# EAGLE board LCMeter (EAGLE 6.1)
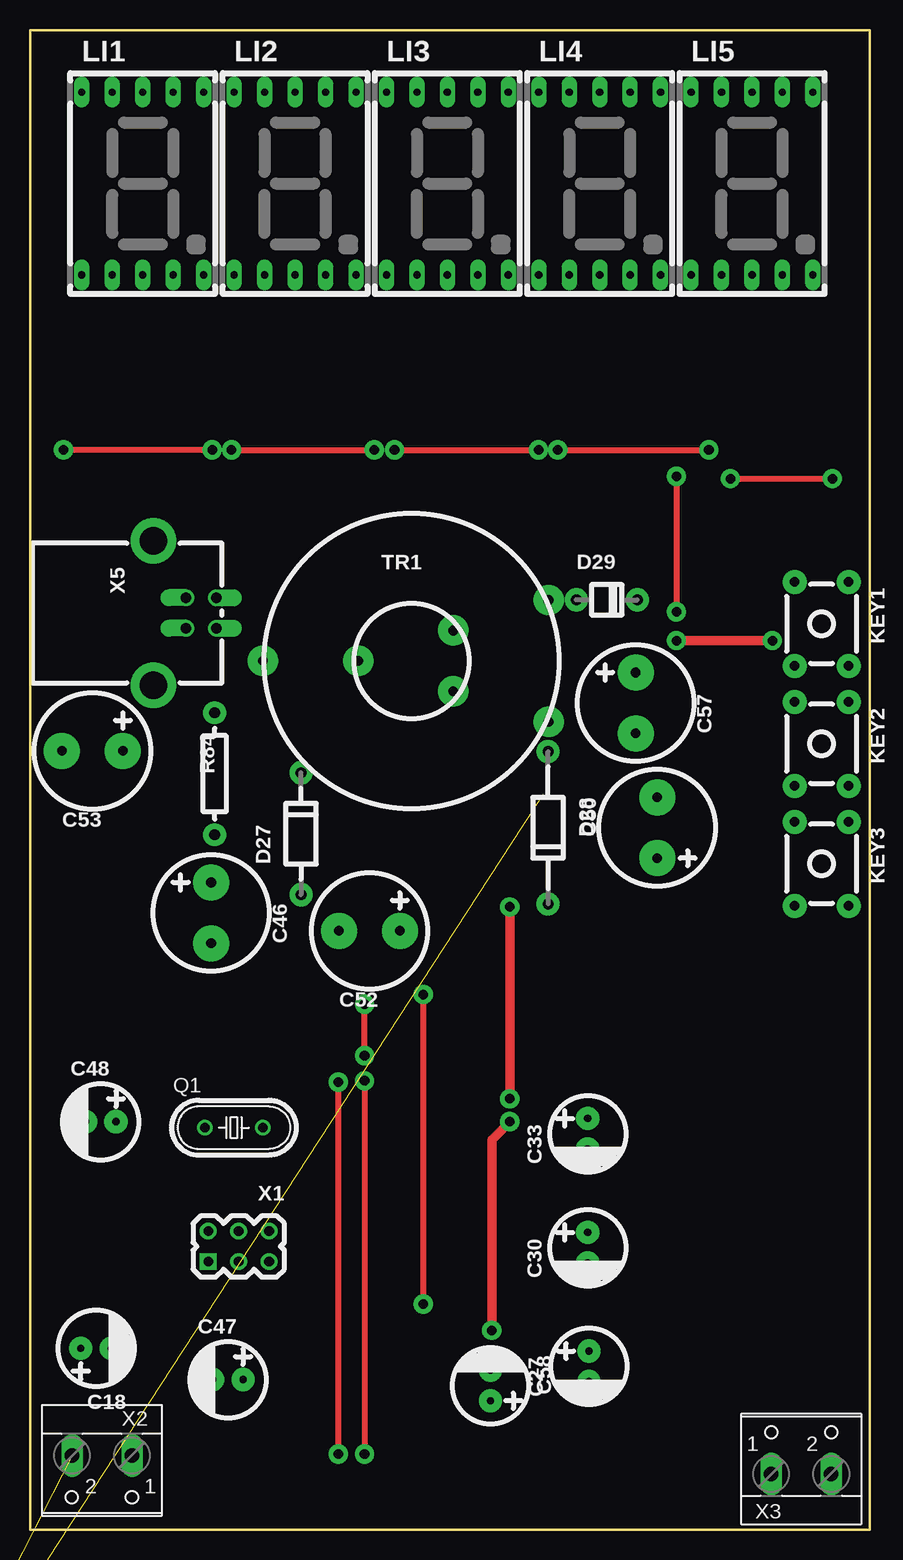
[diagram p4: board, top side]
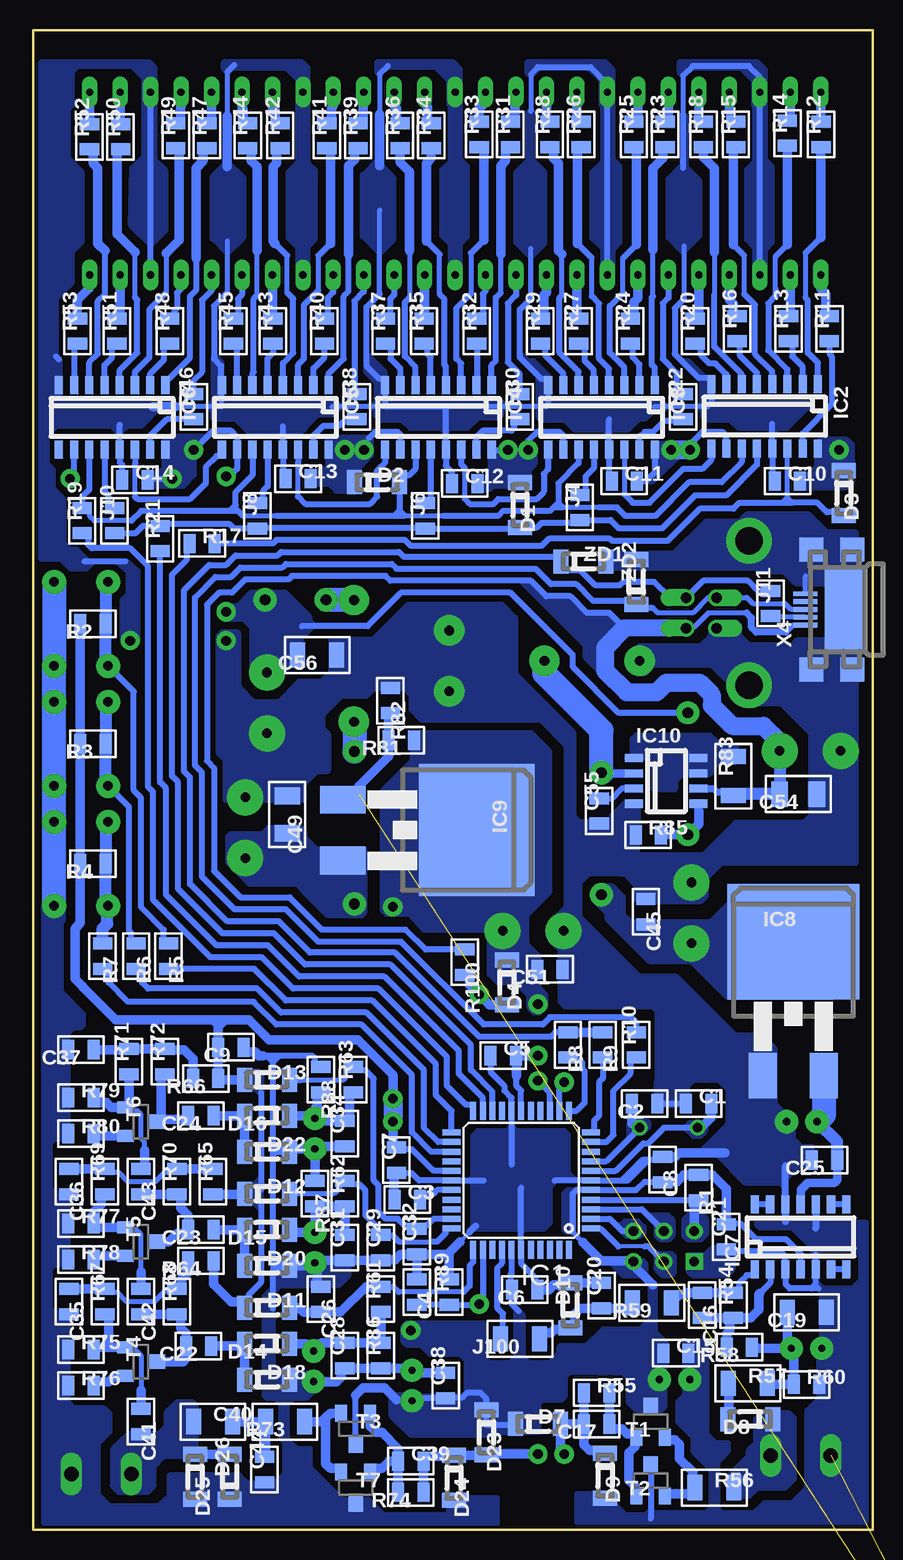
[diagram p5: board, bottom side, seen from below]

Size 70 x 125 mm. Coordinates in mm from the lower left corner, seen from the top.
Outline: 0,0 0,125 70,125 70,0 0,0
Copper layers (1*16): Top 0.035mm / dielectric 1.5mm / Bottom 0.035mm
Design rules: minimum track width 0.35mm, minimum drill 0.6mm, track to track 0.25mm, track to pad 0.25mm, pad to pad 0.25mm, via to via 0.35mm, smd to smd 8mil, copper to edge 0.2mm, drill to drill 8mil, minimum pad ring 10mil, minimum via ring 8mil, stop-mask expansion 4mil, vias tented up to drill 0mil, thermal gap 10mil

## Footprints (pad centres in the part's own frame; a part is rotated, then mirrored left to right if it is on the bottom)
RSMD_0805 = smd 1 x 1.6: PAD_0 -1.05,0; PAD_1 1.05,0
CE_6.3MM = drill 0.6 pad 1.93: + 1.27,0; - -1.27,0
RSMD_1206_BIG_GAP = smd 1.25 x 2.1: PAD_0 -1.625,0; PAD_1 1.625,0
CE_10MM = drill 0.8 pad 3: + 2.54,0; - -2.54,0
RSMD_1206 = smd 1.4 x 2.1: PAD_0 -1.55,0; PAD_1 1.55,0
SOD-80 = smd 1.25 x 2: ANODE 1.875,0; CATHODE -1.875,0
DO-41_10MM = drill 0.9 pad 1.93: ANODE -5.08,0; CATHODE 5.08,0
DO-41_12.5MM = drill 0.9 pad 1.93: ANODE -6.35,0; CATHODE 6.35,0
DO-41_5MM = drill 0.9 pad 1.93: ANODE -2.54,0; CATHODE 2.54,0
TQFP44 = smd 1.5 x 0.5: 1 -5.8,4; 2 -5.8,3.2; 3 -5.8,2.4; 4 -5.8,1.6; 5 -5.8,0.8; 6 -5.8,0; 7 -5.8,-0.8; 8 -5.8,-1.6; 9 -5.8,-2.4; 10 -5.8,-3.2; 11 -5.8,-4; 23 5.8,-4; 24 5.8,-3.2; 25 5.8,-2.4; 26 5.8,-1.6; 27 5.8,-0.8; 28 5.8,0; 29 5.8,0.8; 30 5.8,1.6; 31 5.8,2.4; 32 5.8,3.2; 33 5.8,4 | smd 0.5 x 1.5: 12 -4,-5.8; 13 -3.2,-5.8; 14 -2.4,-5.8; 15 -1.6,-5.8; 16 -0.8,-5.8; 17 0,-5.8; 18 0.8,-5.8; 19 1.6,-5.8; 20 2.4,-5.8; 21 3.2,-5.8; 22 4,-5.8; 34 4,5.8; 35 3.2,5.8; 36 2.4,5.8; 37 1.6,5.8; 38 0.8,5.8; 39 0,5.8; 40 -0.8,5.8; 41 -1.6,5.8; 42 -2.4,5.8; 43 -3.2,5.8; 44 -4,5.8
SOIC16 = smd 1.5 x 0.68: 1 -2.699,4.445; 2 -2.699,3.175; 3 -2.699,1.905; 4 -2.699,0.635; 5 -2.699,-0.635; 6 -2.699,-1.905; 7 -2.699,-3.175; 8 -2.699,-4.445; 9 2.699,-4.445; 10 2.699,-3.175; 11 2.699,-1.905; 12 2.699,-0.635; 13 2.699,0.635; 14 2.699,1.905; 15 2.699,3.175; 16 2.699,4.445
SOIC14 = smd 1.5 x 0.68: 1 -2.699,3.81; 2 -2.699,2.54; 3 -2.699,1.27; 4 -2.699,0; 5 -2.699,-1.27; 6 -2.699,-2.54; 7 -2.699,-3.81; 8 2.699,-3.81; 9 2.699,-2.54; 10 2.699,-1.27; 11 2.699,0; 12 2.699,1.27; 13 2.699,2.54; 14 2.699,3.81
D2PAK = smd 2.32 x 3.81: 1 -2.54,-11.17; 3 2.54,-11.17 | smd 11 x 9.65: 2 0,0
SOIC8 = smd 1.5 x 0.68: 1 -2.699,1.905; 2 -2.699,0.635; 3 -2.699,-0.635; 4 -2.699,-1.905; 5 2.699,-1.905; 6 2.699,-0.635; 7 2.699,0.635; 8 2.699,1.905
KEY_7X4.5 = drill 0.8 pad 2: 1 -3.5,-2.25; 2 3.5,-2.25; 3 3.5,2.25; 4 -3.5,2.25
KEM-5161(NARROW) = drill 0.6 pad 1.3 long: 1 -5.08,-7.62; 2 -2.54,-7.62; 3 0,-7.62; 4 2.54,-7.62; 5 5.08,-7.62; 6 5.08,7.62; 7 2.54,7.62; 8 0,7.62; 9 -2.54,7.62; 10 -5.08,7.62
HC49U-V = drill 0.813: 1 -2.413,0; 2 2.413,0
R0207 = drill 0.9 pad 1.9: PAD1 5.08,0; PAD_0 -5.08,0
SOT23_SMALL_PADS = smd 1 x 1.4: 1 1.2,1.3; 2 -1.2,1.3 | smd 1.2 x 1.4: 3 0,-1.3
RING_25X10_3WIND_HOR = drill 0.8 pad 2.54: W1_END -4.445,0; W1_START -12.383,0; W2_END 3.493,2.54; W2_START 11.43,5.08; W3_END 3.493,-2.54; W3_START 11.43,-5.08
PIN2X3_2.54MM_LOOSE_PADS = drill 0.8 pad 1.4 square: 1 -2.54,-1.27 | drill 0.8 pad 1.4: 2 -2.54,1.27; 3 0,-1.27; 4 0,1.27; 5 2.54,-1.27; 6 2.54,1.27
W237-102 = drill 1.194 long: 1 -2.5,-1.27; 2 2.5,-1.27
USB_MICRO_TYPE_B = smd 0.4 x 2: 1 -1.3,5.2; 2 -0.65,5.2; 3 0,5.2; 4 0.65,5.2; 5 1.3,5.2 | smd 7.4 x 3.2: PACKAGE1 0,2 | smd 2 x 2: PACKAGE2 -5,4.7; PACKAGE3 -5,1.3; PACKAGE4 5,1.3; PACKAGE5 5,4.7
USB_TYPE_B_SMALL_PADS = drill 0.9 pad 1.4 offset: 1 1.27,2.54; 2 -1.27,2.54; 3 -1.27,0; 4 1.27,0 | drill 2.3 pad 3.81: PACKAGE_PAD1 -6.02,-2.71; PACKAGE_PAD2 6.02,-2.71

## Placement (x,y rotation side)
C1  22pF  [RSMD_0805]  14.5,35.5 0 bottom
C2  22pF  [RSMD_0805]  19,35.5 180 bottom
C3  0.1uF  [RSMD_0805]  38.8,27.5 0 bottom
C4  0.1uF  [RSMD_0805]  38,19.8 270 bottom
C5  0.1uF  [RSMD_0805]  30.8,39.5 0 bottom
C6  0.1uF  [RSMD_0805]  29,20 180 bottom
C7  0.1uF  [RSMD_0805]  39.7,30.8 90 bottom
C8  0.1uF  [RSMD_0805]  17.5,30 270 bottom
C9  0.1uF  [RSMD_0805]  53.5,40.2 180 bottom
C10  0.1uF  [RSMD_0805]  7.1,87.4 0 bottom
C11  0.1uF  [RSMD_0805]  20.7,87.4 0 bottom
C12  0.1uF  [RSMD_0805]  34,87.2 0 bottom
C13  0.1uF  [RSMD_0805]  47.9,87.6 0 bottom
C14  0.1uF  [RSMD_0805]  61.5,87.5 0 bottom
C15  0.47uF  [RSMD_0805]  16.4,14.7 0 bottom
C16  0.1uF  [RSMD_0805]  14.2,18.7 270 bottom
C17  1nF  [RSMD_0805]  23,8.8 180 bottom
C18  22uFx16V  [CE_6.3MM]  5.5,15.1 180 top
C19  0.47uF  [RSMD_1206_BIG_GAP]  5.5,18.1 180 bottom
C20  0.1uF  [RSMD_0805]  22.6,19.5 90 bottom
C21  0.1uF  [RSMD_0805]  12.2,24.4 90 bottom
C22  0.1uF  [RSMD_0805]  56.2,15.3 180 bottom
C23  0.1uF  [RSMD_0805]  56,25 180 bottom
C24  0.1uF  [RSMD_0805]  56,34.5 180 bottom
C25  0.1uF  [RSMD_0805]  4,30.8 180 bottom
C26  0.1uF  [RSMD_0805]  46,19.2 270 bottom
C27  22uFx16V  [CE_6.3MM]  46.6,13.6 90 top
C28  0.1uF  [RSMD_0805]  44,14.5 90 bottom
C29  0.1uF  [RSMD_0805]  41,23.5 90 bottom
C30  22uFx16V  [CE_6.3MM]  46.5,23.5 90 top
C31  0.1uF  [RSMD_0805]  44,23.5 90 bottom
C32  0.1uF  [RSMD_0805]  38,24 90 bottom
C33  22uFx16V  [CE_6.3MM]  46.5,33 90 top
C34  0.1uF  [RSMD_0805]  44,33 90 bottom
C35  0.1uF  [RSMD_0805]  67,19 270 bottom
C36  0.1uF  [RSMD_0805]  67,29 270 bottom
C37  0.1uF  [RSMD_0805]  66,40 180 bottom
C38  0.47uF  [RSMD_0805]  35.6,12 90 bottom
C39  1nF  [RSMD_0805]  38.5,5.7 0 bottom
C40  1.0uF  [RSMD_1206_BIG_GAP]  55,9 0 bottom
C41  0.1uF  [RSMD_0805]  61,9 270 bottom
C42  0.1uF  [RSMD_0805]  61,19 270 bottom
C43  0.1uF  [RSMD_0805]  61,29 270 bottom
C44  22nF*  [RSMD_0805]  50.7,5 90 bottom
C45  0.47uFx16V  [RSMD_0805]  18.9,51.5 270 bottom
C46  470uFx16V  [CE_10MM]  15.1,51.4 90 top
C47  100uFx10V  [CE_6.3MM]  16.5,12.5 0 top
C48  47uFx16V  [CE_6.3MM]  5.9,34 0 top
C49  0.47uFx16V  [RSMD_1206]  48.8,59.6 270 bottom
C50  470uFx16V  [CE_10MM]  52.3,58.5 270 top
C51  0.47uFx16V  [RSMD_0805]  26.9,46.7 180 bottom
C52  47uFx16V  [CE_10MM]  28.3,49.9 0 top
C53  1000uFx16V  [CE_10MM]  5.2,64.9 0 top
C54  0.47uFx16V  [RSMD_1206]  6.2,61.3 180 bottom
C55  1n0*  [RSMD_0805]  22.8,59.9 90 bottom
C56  0.47uFx16V  [RSMD_1206_BIG_GAP]  46.3,72.9 180 bottom
C57  470uFx16V  [CE_10MM]  50.5,68.9 90 top
C58  100uFx10V  [CE_6.3MM]  38.4,12 270 top
D1  LL4148  [SOD-80]  29.4,85.4 270 bottom
D2  LL4148  [SOD-80]  41.3,87.3 0 bottom
D3  LL4148  [SOD-80]  2.4,86.4 270 bottom
D4  LL4148  [SOD-80]  30.5,45.6 270 bottom
D7  LL4148  [SOD-80]  27.9,8.8 0 bottom
D8  LL4148  [SOD-80]  10.2,9.2 180 bottom
D9  LL4148  [SOD-80]  22.3,4.5 270 bottom
D10  LL4148  [SOD-80]  25.2,18.7 90 bottom
D11  LL4148  [SOD-80]  50.5,18.5 0 bottom
D12  LL4148  [SOD-80]  50.5,28 0 bottom
D13  LL4148  [SOD-80]  50.5,37.5 0 bottom
D14  LL4148  [SOD-80]  50.5,15.5 180 bottom
D15  LL4148  [SOD-80]  50.5,25 180 bottom
D16  LL4148  [SOD-80]  50.5,34.5 180 bottom
D18  LL4148  [SOD-80]  50.5,12.5 0 bottom
D20  LL4148  [SOD-80]  50.5,22 0 bottom
D22  LL4148  [SOD-80]  50.5,31.5 0 bottom
D23  LL4148  [SOD-80]  32.2,8.1 270 bottom
D24  LL4148  [SOD-80]  34.9,4.3 270 bottom
D25  LL4148  [SOD-80]  56.5,4.4 270 bottom
D26  LL4148  [SOD-80]  53.6,4.4 90 bottom
D27  FR207  [DO-41_10MM]  22.6,58 90 top
D28  FR207  [DO-41_12.5MM]  43.2,58.5 270 top
D29  FR207  [DO-41_5MM]  48.1,77.5 0 top
IC1  MEGA8535  [TQFP44]  29.3,29.1 180 bottom
IC2  74HC595  [SOIC16]  9,92.8 270 bottom
IC3  74HC595  [SOIC16]  22.6,92.7 270 bottom
IC4  74HC595  [SOIC16]  36.2,92.7 270 bottom
IC5  74HC595  [SOIC16]  49.8,92.7 270 bottom
IC6  74HC595  [SOIC16]  63.4,92.7 270 bottom
IC7  LM324  [SOIC14]  6,24.4 90 bottom
IC8  7905  [D2PAK]  6.6,49 0 bottom
IC9  LM317  [D2PAK]  33,58.3 270 bottom
IC10  MC34063  [SOIC8]  17.2,62.4 0 bottom
J4  0  [RSMD_0805]  24.4,85.2 90 bottom
J6  0  [RSMD_0805]  37.3,84.5 90 bottom
J8  0  [RSMD_0805]  51.3,84.5 90 bottom
J10  0  [RSMD_0805]  63.2,84.1 90 bottom
J11  0  [RSMD_0805]  8.5,77.2 90 bottom
J100  0  [RSMD_1206_BIG_GAP]  29.4,15.9 180 bottom
KEY1  MODE  [KEY_7X4.5]  66,75.5 270 top
KEY2  RANGE  [KEY_7X4.5]  66,65.5 270 top
KEY3  RESERVED  [KEY_7X4.5]  66,55.5 270 top
LI1  KEM5161AR  [KEM-5161(NARROW)]  9.4,112.2 0 top
LI2  KEM5161AR  [KEM-5161(NARROW)]  22.1,112.2 0 top
LI3  KEM5161AR  [KEM-5161(NARROW)]  34.8,112.2 0 top
LI4  KEM5161AR  [KEM-5161(NARROW)]  47.5,112.2 0 top
LI5  KEM5161AR  [KEM-5161(NARROW)]  60.2,112.2 0 top
Q1  12MHz  [HC49U-V]  17,33.5 0 top
R1  4K7  [RSMD_0805]  14.5,28.5 270 bottom
R2  4K7  [RSMD_0805]  65,75.5 180 bottom
R3  4K7  [RSMD_0805]  65,65.5 180 bottom
R4  4K7  [RSMD_0805]  65,55.5 180 bottom
R5  4K7  [RSMD_0805]  58.7,47.8 270 bottom
R6  4K7  [RSMD_0805]  61.4,47.8 270 bottom
R7  4K7  [RSMD_0805]  64.2,47.8 270 bottom
R8  68R  [RSMD_0805]  25.4,40.4 270 bottom
R9  1K5  [RSMD_0805]  22.5,40.4 270 bottom
R10  68R  [RSMD_0805]  19.7,40.4 90 bottom
R11  560R  [RSMD_0805]  3.6,100.1 90 bottom
R12  560R  [RSMD_0805]  4.3,116.3 90 bottom
R13  560R  [RSMD_0805]  7,100.1 90 bottom
R14  560R  [RSMD_0805]  7.1,116.4 90 bottom
R15  560R  [RSMD_0805]  11.4,116.3 90 bottom
R16  560R  [RSMD_0805]  11.3,100.1 90 bottom
R17  300R  [RSMD_0805]  55.9,82.2 0 bottom
R18  560R  [RSMD_0805]  14.1,116.3 90 bottom
R19  300R  [RSMD_0805]  65.9,84.1 90 bottom
R20  560R  [RSMD_0805]  14.8,99.9 90 bottom
R21  300R  [RSMD_0805]  59.4,82.6 90 bottom
R22  560R  [RSMD_0805]  15.8,93.6 90 bottom
R23  560R  [RSMD_0805]  17.3,116.3 90 bottom
R24  560R  [RSMD_0805]  20.2,99.9 90 bottom
R25  560R  [RSMD_0805]  19.9,116.3 90 bottom
R26  560R  [RSMD_0805]  24.3,116.3 90 bottom
R27  560R  [RSMD_0805]  24.5,99.9 90 bottom
R28  560R  [RSMD_0805]  26.9,116.3 90 bottom
R29  560R  [RSMD_0805]  27.7,99.9 90 bottom
R30  560R  [RSMD_0805]  29.4,93.6 90 bottom
R31  560R  [RSMD_0805]  30.2,116.3 90 bottom
R32  560R  [RSMD_0805]  33,99.9 90 bottom
R33  560R  [RSMD_0805]  32.8,116.3 90 bottom
R34  560R  [RSMD_0805]  36.8,116.2 90 bottom
R35  560R  [RSMD_0805]  37.4,99.9 90 bottom
R36  560R  [RSMD_0805]  39.4,116.2 90 bottom
R37  560R  [RSMD_0805]  40.6,99.9 90 bottom
R38  560R  [RSMD_0805]  43,93.6 90 bottom
R39  560R  [RSMD_0805]  42.9,116.2 90 bottom
R40  560R  [RSMD_0805]  45.7,99.9 90 bottom
R41  560R  [RSMD_0805]  45.5,116.2 90 bottom
R42  560R  [RSMD_0805]  49.4,116.2 90 bottom
R43  560R  [RSMD_0805]  50,99.9 90 bottom
R44  560R  [RSMD_0805]  52.1,116.2 90 bottom
R45  560R  [RSMD_0805]  53.3,99.9 90 bottom
R46  560R  [RSMD_0805]  56.6,93.6 90 bottom
R47  560R  [RSMD_0805]  55.5,116.2 90 bottom
R48  560R  [RSMD_0805]  58.6,99.9 90 bottom
R49  560R  [RSMD_0805]  58.1,116.2 90 bottom
R50  560R  [RSMD_0805]  62.7,116.1 90 bottom
R51  560R  [RSMD_0805]  63,99.9 90 bottom
R52  560R  [RSMD_0805]  65.3,116.1 90 bottom
R53  560R  [RSMD_0805]  66.3,99.9 90 bottom
R54  120K  [RSMD_0805]  11.6,18.7 90 bottom
R55  2K2  [RSMD_0805]  23,11.4 0 bottom
R56  300R  [RSMD_1206_BIG_GAP]  13.2,3.5 0 bottom
R57  ***  [RSMD_1206_BIG_GAP]  10.4,12.2 0 bottom
R58  24K  [RSMD_0805]  11.1,15.2 180 bottom
R59  1K0  [RSMD_1206_BIG_GAP]  18.4,18.9 180 bottom
R60  4K7  [RSMD_0805]  5.5,12.1 0 bottom
R61  1K0  [RSMD_0805]  41,19.2 90 bottom
R62  1K0  [RSMD_0805]  44,28 90 bottom
R63  1K0  [RSMD_0805]  43.3,37.5 90 bottom
R64  100R  [RSMD_0805]  56,22.4 180 bottom
R65  100R  [RSMD_0805]  55,29 90 bottom
R66  100R  [RSMD_0805]  55.6,37.6 180 bottom
R67  120K  [RSMD_0805]  64,19 90 bottom
R68  1K0  [RSMD_0805]  58,19 90 bottom
R69  120K  [RSMD_0805]  64,29 90 bottom
R70  1K0  [RSMD_0805]  58,29 90 bottom
R71  120K  [RSMD_0805]  62,39 90 bottom
R72  1K0  [RSMD_0805]  59,39 90 bottom
R73  47R  [RSMD_1206_BIG_GAP]  49,9 180 bottom
R74  2K2  [RSMD_0805]  38.5,3.1 180 bottom
R75  24K  [RSMD_0805]  66,15 0 bottom
R76  100R  [RSMD_0805]  66,12 0 bottom
R77  24K  [RSMD_0805]  66,25.5 0 bottom
R78  100R  [RSMD_0805]  66,22.5 0 bottom
R79  24K  [RSMD_0805]  66,36 0 bottom
R80  100R  [RSMD_0805]  66,33 0 bottom
R81  1K1 1%  [RSMD_0805]  39.3,65.8 180 bottom
R82  3K3 1%  [RSMD_0805]  40.2,69.1 270 bottom
R83  0.62R  [RSMD_1206_BIG_GAP]  11.6,62.8 90 bottom
R84  4K7  [R0207]  15.4,63 90 top
R85  1K6  [RSMD_0805]  18.7,57.9 0 bottom
R86  10K  [RSMD_0805]  41,14.5 90 bottom
R87  10K  [RSMD_0805]  46.5,28 270 bottom
R88  10K  [RSMD_0805]  46,37.5 270 bottom
R89  3K0  [RSMD_0805]  35.3,19.8 90 bottom
R90  100K*  [RSMD_0805]  -1.2,-5 0 top  (outside the outline)
R100  10K  [RSMD_0805]  34,47.3 270 bottom
T1  BC847  [SOT23_SMALL_PADS]  18.5,9 180 bottom
T2  BC857  [SOT23_SMALL_PADS]  18.5,4.1 180 bottom
T3  BC847  [SOT23_SMALL_PADS]  43.1,8.4 0 bottom
T4  BC847  [SOT23_SMALL_PADS]  61,14 90 bottom
T5  BC847  [SOT23_SMALL_PADS]  61,24 90 bottom
T6  BC847  [SOT23_SMALL_PADS]  61,34 90 bottom
T7  BC857  [SOT23_SMALL_PADS]  43.1,3.5 0 bottom
TR1  TRANS  [RING_25X10_3WIND_HOR]  31.8,72.4 0 top
X1  MCU_PROGRAMMING  [PIN2X3_2.54MM_LOOSE_PADS]  17.4,23.6 0 top
X2  L_X  [W237-102]  6,4.9 180 top
X3  C_X  [W237-102]  64.3,5.9 0 top
X4  USB_MICRO  [USB_MICRO_TYPE_B]  0.4,76.7 90 bottom
X5  USB_B  [USB_TYPE_B_SMALL_PADS]  13,76.4 270 top
ZD1  3V6  [SOD-80]  24.1,80.7 0 bottom
ZD2  3V6  [SOD-80]  19.7,79 90 bottom

## Tracks (layer width: path | path; a pad name or v marks a point on that pad's centre or on a via)
+5V_FINE  (via drill 0.8 pad 1.6)
  Top 0.5: v27.9,39.5 v27.9,43.8
  Top 0.8: v40,35.9 v40,51.9 | v40,34 38.5,32.5 v38.5,16.6
  Bottom 0.4: 24.13,23.93 25,24.8
  Bottom 0.5: 25,24.8 25,28 24.7,28.3 IC1.5 19.7,28.3 19,29 17.55,29 C8.PAD_1 | IC1.27 36.6,29.9 38.4,31.7 39.7,31.7 C7.PAD_1 | IC1.17 29.3,36.6 29.7,37 29.7,37.8 | IC7.4 6,23 7.2,24.2 9.7,24.2 11,25.5 12.2,25.5 C21.PAD_1 | C6.PAD_1 30,20.05 30.05,20.1 | C6.PAD_1 30.1,19.95 30.1,18.8 29.5,18.2 | T3.3 43.1,11.2 | 29.5,9.07 D7.CATHODE 29.88,8.7 32.2,8.7 D23.CATHODE 32.2,10.9 32.7,11.4 33.8,11.4 34.2,11 35.55,11 C38.PAD_0 38.18,10.95 C58.+ | IC1.38 30.1,21.3 30.2,21.2 30.2,20.15 C6.PAD_1 | 65.8,45.2 65.9,45.3 | 52.38,18.6 52,18.98 52,19.6 51,20.6 51,27.3 | 66.05,65.55 R3.PAD_1 | 51,36.4 51,28.3
  Bottom 0.8: R2.PAD_1 66.05,65.55 66.1,65.5 | R3.PAD_1 R4.PAD_1 66.05,50.55 66.5,50.1 66.5,45.9 65.9,45.3 | 65.8,45.2 63.1,42.5 55,42.5 | D11.CATHODE 52.38,18.6 52.4,18.6 52.8,19 53.5,19 54.95,20.45 R64.PAD_0 | 43.1,11.2 42.5,11.8 40.7,11.8 39.7,10.8 | 18.3,20.4 19.94,22.04 X1.5 20.01,22.4 22.6,22.4 24.13,23.93 | v40,35.9 40,37.9 42.9,40.8 50.3,40.8 52,42.5 54,42.5 | D13.CATHODE 54.55,37.5 R66.PAD_0 C9.PAD_1 54.55,41.95 54.5,42 | v40,34 40,32.15 C7.PAD_1 | D12.CATHODE 52.42,27.95 R65.PAD_0 | v27.9,39.5 C5.PAD_1 29.7,39.45 29.7,37.8 | 12.2,25.5 12.2,28.4 13.35,29.55 R1.PAD_0 15.75,29.55 16.35,28.95 C8.PAD_1 | 54,42.5 54.5,42 | 54.5,42 55,42.5 | 55,42.5 54,42.5
  Bottom 1.6: v40,35.9 v40,34
  pour Bottom (no thermals): 27.3,44.6 27.3,43.6 27.8,43.1 28.2,43.1 28.6,43.5 28.6,44.5 29.7,45.6 31.2,45.6 31.9,46.3 31.9,50 37.4,50 38.6,51.3 40.5,51.3 40.8,51.6 40.8,61.6 38.3,64.1 38.3,66.4 28.5,66.4 27,64.9 27,53.1 28.9,51.2 28.9,48.8 27.9,47.8 27.9,45.2
  pour Bottom (no thermals): 17.4,13.7 17.4,10.2 17.6,10 19.7,10 20.3,10.6 20.3,12.6 20.8,13.1 25.3,13.1 25.7,12.7 25.7,11.1 26,10.8 27.6,10.8 27.9,10.5 27.9,8.1 31,8.1 31.2,7.9 38.5,7.9 40.1,9.5 40.1,11 39.9,11.2 37.9,11.2 37.8,11.1 34.1,11.1 33.8,11.4 33.8,14.1 34.3,14.6 36.8,14.6 37.6,15.4 38.8,15.4 39.1,15.7 39.1,16.9 38.8,17.2 32.5,17.2 32.5,14.4 32,13.9 30.2,13.9 29.7,14.4 29.7,18.4 29.2,17.9 29.2,14.4 28.7,13.9 26.9,13.9 26.1,14.7 26.1,15.2 26,15.3 23.8,15.3 22.4,16.7 19.3,16.7 18.5,17.5 18.5,20.4 18.3,20.6 18.2,20.5 18.2,16.5 17.2,15.5 17.2,13.9
  pour Bottom (no thermals): 19,21.2 20.8,21.2 22,22.4 19.2,22.4 19,22.2
  pour Bottom (no thermals): 52.6,28.7 52.6,27.3 51.6,27.3 51,26.7 51,29.3 51.6,28.7
  pour Bottom (no thermals): 51,36.3 51.5,36.8 52.5,36.8 52.5,38.2 51.3,38.2 51,37.9
  pour Bottom (no thermals): 25,24.8 25.5,24.8 25.7,25 25.7,28 25.4,28.3 24.7,28.3 25,28 25,27.1
+5V_USB
  Bottom 0.4: X4.1 6.6,75.4 7.2,74.8 | 10.5,76.4 13.7,76.4 14.9,75.2 15.47,75.2 X5.1
  Bottom 0.5: 20.67,75.13 21.94,76.4 23.8,76.4 25.2,77.8 27.2,77.8 28.5,79.1 40.2,79.1 40.6,79.5 48.4,79.5 48.7,79.2 52.3,79.2 53.4,78.1 54.5,78.1 55.5,77.1 55.5,64.1 54.9,63.5 54.9,54.9 52.7,52.7 48.6,52.7 45.9,50 38.9,50 37.25,48.35 R100.PAD_0
  Bottom 0.6: IC10.6 13.27,61.77 13,61.5 11.93,61.5 R83.PAD_0 | 7.2,74.8 9.7,74.8 10.1,75.2 10.1,76 10.5,76.4
  Bottom 1: C53.+ C54.PAD_1 11.47,61.3 R83.PAD_0
  Bottom 1.4: X5.1 20.67,75.13
  Bottom 1.5: C53.+ 7.74,65.64 9.1,67 11.7,67 13.4,68.7 13.4,69.6 14.4,70.6 17.2,70.6 18,69.8 20.5,69.8 22.3,71.6 22.3,73.5 20.67,75.13
  pour Bottom (no thermals): 22.8,71.6 23.9,72.7 23.9,73.7 29.3,79.1 28.5,79.1 27.2,77.8 25.2,77.8 23.8,76.4 21.9,76.4 21.1,75.6 21.1,74.4 21.8,73.7 21.8,71.6
-5V_FINE
  Bottom 0.7: IC7.11 6,28.3 5.4,28.9 3.2,28.9 2.95,29.15 C25.PAD_0
  Bottom 1: C25.PAD_0 2.95,32.32 C48.-
  Bottom 2: IC8.3 4.06,34.57 C48.-
BATTERY_ADC  (via drill 0.8 pad 1.6)
  Top 0.5: v32.8,18.8 v32.8,44.6
  Bottom 0.5: IC1.35 32.5,19.1 v32.8,18.8 32.85,18.75 R89.PAD_0 C4.PAD_1
  Bottom 0.8: D4.ANODE 31.93,43.73 v32.8,44.6 33.6,45.4 33.6,46.25 R100.PAD_1
ESR_ADC_1X
  Bottom 0.4: 34.1,19.8 39.5,19.8
  Bottom 0.5: 39.5,19.8 39.95,20.25 R61.PAD_1 | IC1.34 33.3,22.3 33.6,22 33.6,20.3 34.1,19.8
  Bottom 0.8: D11.ANODE 47.8,18.5 47.4,18.1 46.05,18.1 C26.PAD_1 44.35,18.15 42.25,20.25 R61.PAD_1
ESR_ADC_10X
  Bottom 0.4: 44.5,28.4 44.9,28 D12.ANODE | 39.5,24 36.7,24
  Bottom 0.5: 39.5,24 40,24.5 40.95,24.5 C29.PAD_1 41.5,25.05 41.5,25.4 42.3,26.2 42.3,28.3 42.8,28.8 43.75,28.8 R62.PAD_1 arc-90 44.5,28.55 44.5,28.4 | IC1.33 35.6,25.1 35.6,24.7 36.3,24 36.7,24
ESR_ADC_100X
  Bottom 0.4: 47.6,37.5 44.1,37.5 43.9,37.7 43.9,38.2 43.55,38.55 R63.PAD_1
  Bottom 0.5: IC1.32 36.6,25.9 37.2,25.3 37.75,25.3 C32.PAD_1 38.25,25.3 39,25.3 39.6,25.9 40.6,25.9 41.2,26.5 41.2,28.7 41.6,29.1 41.6,37.6 42.3,38.3 43.05,38.3 R63.PAD_1 | D13.ANODE 47.6,37.5
ESR_PWM  (via drill 0.8 pad 1.6)
  Top 0.5: v27.9,37.4 v27.9,6.3
  Bottom 0.5: IC1.14 26.9,36.4 v27.9,37.4 | R74.PAD_0 37.33,2.98
  Bottom 0.8: R74.PAD_0 C39.PAD_1 37.05,6.1 34.98,6.1 D24.CATHODE 32.25,6.17 D23.ANODE 32.12,6.3 v27.9,6.3
GND  (via drill 0.8 pad 1.6)  (1 unrouted)
  Top 0.8: v53.9,74.1 v61.9,74.1
  Bottom 0.35: 34.4,24 33.6,24.8
  Bottom 0.4: 13.74,93.6 18.2,93.6 | 53.8,107.4 53.8,103.1 | 27.2,93.6 35.7,93.6 | 40.5,93.6 45.1,93.6 | 41.1,103 41.1,110 | 54.3,93.6 58.1,93.6 | X4.5 5.6,79.5 | 28.5,102.6 28.5,106.8 | 27.9,121.9 28.5,121.3 28.5,118.2 | 41.1,121.3 41.1,118 | 53.8,121.5 53.8,117.8 | 15.8,121.2 15.8,118 | 15.7,102.6 15.7,107
  Bottom 0.5: LI1.3 LI1.8 9.4,121.1 10.3,122 15,122 15.8,121.2 | LI2.3 LI2.8 22.1,120.5 23.5,121.9 27.9,121.9 | 67.05,27.9 C36.PAD_1 67.05,28 | 67.05,18 C35.PAD_1 67.05,17.9 | X3.2 67.05,4.88 | 50,18.4 50,21.6 | 50,22.4 50,31.2 | 50,32 50,39 | 30.1,30.4 IC1.18 30.1,36 30.7,36.6 30.7,37 31.85,38.15 C5.PAD_0 | 26.5,29.1 IC1.6 20.9,29.1 | C1.PAD_0 C2.PAD_0 | R88.PAD_0 46.05,38.5 46.5,38.5 46.5,39.3 46.7,39.5 49.5,39.5 | 15.7,102.6 16.5,101.8 16.5,98 14.5,96 13.7,96 13.45,95.75 IC2.8 13.45,93.94 | 8.37,92.17 IC2.13 8.37,87.61 C10.PAD_0 | 21.96,92.53 IC3.13 21.96,87.61 C11.PAD_0 | 48.9,87.6 C13.PAD_0 49.16,87.6 IC5.13 49.16,91.97 | 28.5,102.6 29.4,101.7 29.4,97.7 27.6,95.9 27.05,95.9 IC3.8 27.05,93.75 | 53.2,122.1 53.8,121.5 | 41.1,103 42.2,101.9 42.2,97 41.1,95.9 40.65,95.9 IC4.8 40.65,93.75 40.5,93.6 35.7,93.6 35.56,93.47 IC4.13 35.56,88.67 35.05,88.15 C12.PAD_0 | 41.1,121.3 40.4,122 | 53.8,103.1 54.9,102 54.9,97.6 54.3,97 54.3,95.45 | IC5.8 54.3,95.45 | 54.3,95.45 54.3,94.1 | 67.84,97.55 68.1,97.8 | LI5.3 LI5.8 | C14.PAD_0 62.55,88.75 62.77,88.97 IC6.13 62.77,92.06 62.8,92.1 | C21.PAD_0 12.05,23.2 7.7,23.2 7.27,22.77 IC7.3 7.27,20.47 6.9,20.1 5.1,20.1 | 5.1,20.1 4.73,20.47 IC7.5 4.73,22.93 | 4.5,20.1 5.1,20.1 | IC7.10 4.73,25.77 | IC7.12 7.27,25.93 | 29.3,28.5 IC1.39 29.3,22.2 28.1,21 28.1,20.15 C6.PAD_0 | C44.PAD_0 51,3.65 | T2.3 18.5,0.9 | C7.PAD_0 39.6,29.65 39.65,29.65 | 39.65,29.65 39.6,29.7 38.4,29.7 37.8,29.1 IC1.28 32.4,29.1 | 39.65,29.65 39.7,29.6 | C3.PAD_0 39.9,27.5 | KEY3.3 68.2,51.95 | 50,22.4 49.6,22 50,21.6 | 50,22.4 50,21.6 | 50,31.2 49.6,31.6 50,32 | 50,31.2 50,32 | 48.62,31.6 D22.ANODE | 50,39 49.5,39.5 | 49.5,39.5 50.5,39.5
  Bottom 0.5: 50.5,39.5 50,39 | 50.8,39.5 50.5,39.5 | C29.PAD_0 41,22.5 | 62.3,80.7 65.7,80.7 | C8.PAD_0 17.75,30.8 18.7,30.8 | 18.7,30.8 19.2,30.8 20.9,29.1 | 15.8,118 15.8,113.5 | 20.9,29.1 20.4,29.1 18.7,30.8
  Bottom 0.6: 7.27,30.33 IC7.12 7.27,25.67 | IC7.10 4.73,25.13 | 33.6,24.8 33.1,25.3
  Bottom 0.8: C8.PAD_0 16.45,31.05 16.1,31.4 12.3,31.4 | 15.5,35.55 C1.PAD_0 | 34.77,2.55 D24.ANODE | C38.PAD_1 38.18,13.05 C58.- 38.58,13.45 R86.PAD_0 C28.PAD_0 44.3,13.15 44.3,12.7 44.67,12.33 C27.- | C32.PAD_0 39.35,22.95 39.8,22.5 41,22.5 | C29.PAD_0 C31.PAD_0 46.28,22.45 C30.- | C30.- 46.73,22 D20.ANODE 49.6,22 | C34.PAD_0 46.25,31.95 46.5,31.7 | R87.PAD_0 46.5,31.7 | 46.5,31.7 C33.- 48.4,31.73 D22.ANODE | 49.6,31.6 48.62,31.6 | C32.PAD_0 35.45,22.95 | 35.45,22.95 34.4,24 | C4.PAD_0 C32.PAD_0 | R89.PAD_1 35.3,22.8 35.45,22.95 | C20.PAD_1 25.18,20.55 D10.ANODE 25.38,20.4 26.6,20.4 27,20 C6.PAD_0 | C26.PAD_0 46.3,20.55 46.3,21.8 46.5,22 C30.- | 39.9,27.5 39.9,29.75 C7.PAD_0 | 41.1,118 41.1,113.7 | 53.8,117.8 53.8,113.6 | C9.PAD_0 52.05,39.8 51.5,39.8 51.2,39.5 50.8,39.5 | 58.1,93.6 60,93.6
  Bottom 2: KEY1.4 KEY1.3 KEY2.4 KEY2.3 KEY3.4 KEY3.3
  pour Bottom: 26.9,25.6 26.9,28.6 26.4,29.1 24.8,29.1 25.4,29.7 25.4,32.9 25.7,33.2 29.7,33.2 30.1,33.6 30.5,33.2 32.9,33.2 33.3,32.8 33.3,29.4 33.6,29.1 33.3,28.8 33.3,25.1 29.6,25.1 29.3,24.8 29,25.1 27.4,25.1
  pour Bottom (no thermals): 31.3,2.6 35.3,2.6 35.3,1.4 35.5,1.2 40.8,1.2 42,2.4 44.2,2.4 46.9,5.1 46.9,6.7 48,6.7 48.8,7.5 48.8,10.6 48.7,10.6 48.3,11 47.2,11 46.6,11.6 46.6,13 48.6,13 48.8,13.2 49.5,13.2 50,13.7 50,19.8 49.4,20.4 44.5,20.4 43.7,21.2 43.7,22.5 46.5,22.5 46.5,22.2 50,22.2 50,20.1 50.7,19.4 50.7,11.2 50.5,11 49.8,11 49.3,10.5 49.3,7.6 49,7.3 49,4.6 49.6,4 51,4 51.2,3.8 52.1,3.8 52.8,4.5 58.6,4.5 58.6,2.8 59.6,1.9 63.6,1.9 64.6,2.9 64.6,7.2 63.6,8.2 63.6,9.6 64.1,10.1 66.6,10.1 67.1,10.6 67.1,17.9 67,18 68.2,18 68.6,18.4 68.6,21.7 68.2,22.1 67.2,22.1 67.1,22.2 67.1,28 68.2,28 68.6,28.4 68.6,32.2 68.2,32.6 67.2,32.6 67.1,32.7 67.1,41.4 66.6,41.9 66,41.9 65.8,42.1 65.8,42.9 67.7,44.8 67.7,50.6 67.5,50.8 67.5,52.1 67.6,52 69.1,52 69.1,0.6 31.3,0.6
  pour Bottom (no thermals): 30.7,93.6 31,93.3 31,92.9 31.2,92.7 32.9,92.7 33.8,91.8 35.3,91.8 35.6,91.5 35.9,91.8 38.5,91.8 39.2,92.5 41,92.5 41.4,92.9 41.4,93.3 41.7,93.6 41.4,93.9 41,93.9 40.7,94.2 40.6,94.2 40.3,93.9 30.9,93.9
  pour Bottom (no thermals): 59.4,93.6 61,92 62.2,92 62.8,91.4 63.4,92 68.1,92 68.9,91.2 68.9,90.2 69.3,90.2 69.3,122.3 60.3,122.3 59.9,121.9 59.9,114.2 59,113.3 59,108.3 60.2,107.1 61.8,108.7 61.7,113.5 60.7,114.5 60.7,121 61.7,122 66.3,122 66.8,121.5 66.8,118.7 67.1,118.4 67.1,114.3 66,113.2 66,107.3 66.8,106.5 66.8,103.9 68.1,102.6 68.1,97.8 67.8,97.5 67.8,94.2 67.4,93.8 59.6,93.8
  pour Bottom (no thermals): 53.8,114 52.5,112.7 52.5,107.7 53.8,106.4 55,107.6 55,112.8
  pour Bottom (no thermals): 47.1,104.5 47.1,107 46.5,107.6 46.5,113.3 47.1,113.9 47.1,121.8 47.6,122.3 54.1,122.3 54.1,121.8 53.8,121.5 53.4,121.9 48.9,121.9 47.9,120.9 47.9,113.9 48.7,113.1 48.7,107.7 47.9,106.9 47.9,104.5
  pour Bottom (no thermals): 17.2,93.6 17.4,93.4 18.1,93.4 19,92.6 19.5,92.6 20.4,91.7 21.8,91.7 22,91.4 22.3,91.7 24.8,91.7 25.6,92.5 27.6,92.5 27.8,92.7 27.8,93.4 28,93.6 27.6,94 27.4,94 27.1,94.3 27,94.3 26.5,93.8 17.4,93.8
  pour Bottom (no thermals): 5.2,93.8 7.2,91.8 7.9,91.8 8.3,91.4 8.7,91.8 11.1,91.8 11.8,92.5 13.8,92.5 14.1,92.8 14.1,93.2 14.5,93.6 14.2,93.9 14.2,95.7 15.9,97.4 15.4,97.4 14,96 13.5,96 13.5,94.3 13.1,93.9 5.3,93.9
  pour Bottom (no thermals): 2.2,23.3 4.3,23.3 4.7,22.9 5,23.2 5,23.4 5,23.5 6.7,25.2 9.4,25.2 9.7,25.5 7.7,25.5 7.3,25.9 7,25.6 5.7,25.6 4.9,25.6 4.7,25.8 4.5,25.6 2.9,25.6 2.2,25.6 2.2,23.5
  pour Bottom (no thermals): 27.6,67.5 37.6,67.5 38.4,68.3 38.4,69.5 39,70.1 41.6,70.1 42.2,69.5 44.3,69.5 45.9,67.9 45.9,66.8 45.4,66.3 45.4,63.3 45.5,63.2 46.4,63.2 47.5,62.1 47.4,60.8 53.9,60.8 53.9,64.1 54.5,64.7 54.5,74.5 54.2,74.8 53,74.8 52.9,74.7 52.9,70.3 51.6,69 49.5,69 47.8,70.7 45.9,70.7 45.1,71.5 45.1,74.2 41.6,74.2 38.7,77.1 30.9,77.1 29.8,76 29.8,71.3 25,66.5 25,59.5 24.5,59 21.7,59 21.7,59.5 20.7,60.5 19.6,60.5 19.6,57.5 19.7,57.4 19.7,54.8 19.8,54.7 25.5,54.7 25.5,65.3
  pour Bottom (no thermals): 1.4,83.1 3.8,83.1 5.3,84.6 10.5,84.6 11.1,84 13.9,84 16.6,81.3 22.4,81.3 22.4,80.2 9.6,80.2 9.3,79.9 7.4,79.9 6.4,78.9 3.7,78.9 3.7,74.1 6.3,74.1 6.7,73.7 10.3,73.7 11.1,74.5 11.1,75.3 11.4,75.6 13.1,75.6 13.5,75.2 13.5,74.5 14.4,73.6 19.5,73.6 20.4,72.7 20.4,72.1 19.7,71.4 19,71.4 18.3,72.1 13.4,72.1 10.2,68.9 7.6,68.9 5.1,66.4 5.1,59.5 5.7,58.9 11.4,58.9 14.1,56.2 21.1,56.2 21.1,54.7 20.6,54.7 19.7,53.7 19.7,52.6 19.5,52.4 14.3,52.4 13.9,52.8 13.9,54.3 12.6,55.6 1.4,55.6
  pour Bottom (no thermals): 5.1,30.3 6.2,30.3 7.3,29.2 7.3,28.5 7.7,28.9 10.6,28.9 13,31.3 14.5,31.3 12,33.8 12,36.7 12.8,37.5 15,37.5 15.5,37 15.5,35.4 18,35.4 18,37.3 17.9,37.4 17.9,43.2 18.3,43.6 25.6,43.6 26,44 26,48.3 26.8,49.1 26.8,50.6 25.5,51.9 25.5,54.9 23.5,54.9 24.5,53.9 24.5,51.1 19.5,46.1 16.4,46.1 11.5,41.2 9.3,41.2 8.2,40.1 8.2,35.5 7.4,34.7 7.1,34.7 6.7,34.3 6.7,32.6 6,31.9 5.1,31.9
  pour Bottom (no thermals): 0.6,25.6 0.6,0.6 24.6,0.6 24.6,3 21.6,3 21.6,2.2 20.6,1.2 18.9,1.2 18.5,1.6 18.3,1.4 13.8,1.4 13.4,1.8 13.4,5 14.9,6.5 14.9,7.7 16.2,9 16.2,10.6 15.6,11.2 15.6,15.7 14.2,15.7 13.9,15.4 13.9,8 13.1,7.2 12.1,7.2 12.1,6.5 13,5.6 13,1.8 12.6,1.4 9.8,1.4 9,2.2 6.7,2.2 5.4,3.5 5.4,9.9 4.4,10.9 4.4,14.9 4.2,15.1 4.2,19.8 4.7,20.3 4.7,20.6 4.2,20.1 1.6,20.1 0.9,20.8 0.9,22.9 1.3,23.3 2.7,23.3 2.7,25.5 2.6,25.6
  pour Bottom (no thermals): 65.4,80.7 65,80.7 65.6,80.1 66.8,80.1 67.6,80.9 69.3,80.9 69.3,90.2 68.9,90.2 68.9,88.9 68.4,88.4 68.4,86.8 67.5,85.9 67.5,82.2 67,81.7 66.4,81.7
  pour Bottom (no thermals): 62.5,74.1 62.5,77.5 62,78 62,79.8 63,80.7 62.2,80.7 61.3,79.9 61.3,74.1
  pour Bottom (no thermals): 34.4,104.3 34.4,107.2 33.8,107.8 33.8,113.6 34.4,114.2 34.4,121.7 35,122.3 41.3,122.3 41.3,121.5 41.1,121.3 40.4,122 36.5,122 35.3,120.8 35.3,118.8 35.2,118.7 35.2,114 35.9,113.3 35.9,107.9 35.2,107.2 35.2,104.3
  pour Bottom (no thermals): 21.7,104.3 21.7,106.7 21.1,107.3 21.1,113.6 21.7,114.2 21.7,121.7 22.3,122.3 28.8,122.3 28.8,121.5 28.5,121.2 27.7,122 23.8,122 22.6,120.8 22.6,118.8 22.5,118.7 22.5,114 23.4,113.1 23.4,107.7 22.5,106.8 22.5,104.3
  pour Bottom (no thermals): 9,104.3 9,106.7 8.4,107.3 8.4,113.6 9,114.2 9,121.7 9.6,122.3 16.1,122.3 16.1,121.5 15.8,121.2 15.1,121.9 11,121.9 9.9,120.8 9.9,118.8 9.8,118.7 9.8,114 10.5,113.3 10.5,107.6 9.8,106.9 9.8,104.3
  pour Bottom (no thermals): 27.4,113.2 27.4,107.2 28.5,106.1 29.7,107.3 29.7,113.1 28.7,114.1 28.7,118.1 28.5,118.3 28.4,118.2 28.4,114.2
  pour Bottom (no thermals): 41.1,113.8 40,112.7 40,107.5 41.1,106.4 42.5,107.8 42.5,112.9 41.1,114.3
  pour Bottom (no thermals): 15.8,106.5 17,107.7 17,112.6 15.8,113.8 15.8,118 15.6,117.8 15.6,113.6 14.5,112.5 14.5,107.8
  pour Bottom (no thermals): 11.7,23.5 11.7,21.7 12.2,21.2 15,21.2 15.3,21.5 15.3,22.8 15.2,22.9 13.9,22.9 13.3,23.5
  pour Bottom (no thermals): 44.4,93.6 44.7,93.9 45.2,93.9 53.9,93.9 54.3,94.3 54.7,93.9 55,93.9 55.1,93.9 55.4,93.6 55,93.2 55,92.7 54.9,92.6 54.1,92.6 53.1,92.6 52,91.5 49.5,91.5 49.2,91.2 48.9,91.5 48.4,91.5 47.7,91.5 46.8,92.4 46.2,93 45.3,93 45,93
  pour Bottom (no thermals): 27.8,93.9 27.8,96.1 29.4,97.7 29.4,98 28.8,97.4 28.3,97.4 27.1,96.2 27.1,93.9
  pour Bottom (no thermals): 41.3,93.9 41.3,95.6 42.2,96.5 42.2,97.9 42.1,97.9 41.1,96.9 40.7,96.5 40.7,93.9
  pour Bottom (no thermals): 55.4,93.6 54.9,94.1 54.9,95.2 54.9,97.9 54.3,97.3 54.3,93.6
KEY_MODE
  Bottom 0.5: R5.PAD_1 51.55,46.75 48.9,44.1 41.7,44.1 36.4,38.8 36.4,36.2 35.1,34.9 IC1.23
KEY_RANGE
  Bottom 0.5: IC1.24 36.2,32.3 37.4,33.5 37.4,38.3 42.2,43.1 49.3,43.1 51.3,45.1 60.4,45.1 60.9,45.6 60.9,46.25 arc-90 R6.PAD_1
KEY_RESERVED
  Bottom 0.5: IC1.25 36.8,31.5 38.4,33.1 38.4,37.9 42.6,42.1 49.7,42.1 51.6,44 62.1,44 63.7,45.6 63.7,46.25 arc-90 R7.PAD_1
L_ADC
  Bottom 0.8: R59.PAD_1 20.48,18.45 C20.PAD_0 24.35,18.45 24.8,18 24.8,17.23 D10.CATHODE 25.32,16.7 26.5,16.7 26.8,16.4 27.27,16.4 J100.PAD_0
L_PWM  (via drill 0.8 pad 1.6)
  Top 0.5: v25.7,37.3 v25.7,6.3
  Bottom 0.5: IC1.13 26.1,36.9 v25.7,37.3 | 25.62,6.38 v25.7,6.3
  Bottom 0.8: R55.PAD_0 C17.PAD_1 | D9.CATHODE 22.52,6.6 23.6,6.6 24.05,7.05 C17.PAD_1 | C17.PAD_1 D7.ANODE 26.02,6.78 25.62,6.38
LED_DATA
  Bottom 0.5: IC1.20 31.7,36.5 33.5,38.3 33.5,40.4 40.2,47.1 47.3,47.1 49.9,49.7 54.2,49.7 57.9,53.4 57.9,62.3 58.4,62.8 58.4,79.6 57.2,80.8 57.2,81.95 R17.PAD_0
LED_DATA'
  Bottom 0.4: 7.1,86 IC2.14
  Bottom 0.5: D3.ANODE 2.67,84.8 3.8,84.8 4.6,85.6 6.7,85.6 | R17.PAD_1 50,82.2 49.7,82.5 39,82.5 38.5,82 27.6,82 27,82.6 21.9,82.6 21.7,82.4 17.1,82.4 14.4,85.1 11.6,85.1 11.1,85.6 7.5,85.6 | 6.7,85.6 7.1,86 7.5,85.6 | 7.5,85.6 6.7,85.6
LED_LATCH
  Bottom 0.5: IC1.21 32.5,36 34.5,38 34.5,39.9 40.7,46.1 47.8,46.1 50.4,48.7 54.7,48.7 58.9,52.9 58.9,61.8 59.4,62.3 R21.PAD_0
LED_LATCH'
  Bottom 0.5: IC2.12 9.63,88.77 12.2,86.2 14.8,86.2 17.55,83.45 21.15,83.45 21.85,84.15 J4.PAD_0 24.65,83.9 27.6,83.9 27.98,83.53 D1.ANODE 29.4,83.4 37.3,83.4 J6.PAD_0 37.3,83.5 51.3,83.5 J8.PAD_0 53.25,83.45 53.6,83.8 59.25,83.8 R21.PAD_1 60.85,83.65 61.45,83.05 J10.PAD_0
LED_SCK
  Bottom 0.5: R19.PAD_0 65.4,83.05 65.4,82.1 65.1,81.8 61.9,81.8 60.4,80.3 60.4,61.9 60,61.5 60,52.5 55.2,47.7 50.9,47.7 48.3,45.1 41.2,45.1 35.5,39.4 35.5,37 33.9,35.4 33.3,35.4 IC1.22
LED_SCK'
  Bottom 0.4: 22.8,85.2 25.8,85.2 | 35.8,84.5 39.4,84.5 | 49.7,84.5 52.5,84.5 | 61.8,84.1 64.9,84.1 65.3,84.5 65.3,85.15 R19.PAD_1
  Bottom 0.5: IC2.11 10.9,89 12.6,87.3 15.3,87.3 18.1,84.5 20.6,84.5 21.3,85.2 22.8,85.2 | IC3.11 24.5,88.89 26.2,87.2 26.2,85.6 | IC5.11 51.7,87.89 53.1,86.5 53.1,85.4 | IC6.11 65.31,86.69 65.9,86.1 R19.PAD_1 | 61.8,84.1 61,84.9 53.6,84.9 | 26.6,85.2 26.9,84.9 30.8,84.9 31.2,84.5 35.8,84.5 | 26.6,85.2 26.2,85.6 | 26.2,85.6 25.8,85.2 26.6,85.2 | 52.9,84.9 53.6,84.9 | IC4.11 38.1,88.39 38.6,87.9 39.42,87.9 D2.ANODE 39.42,84.92 39,84.5 39.4,84.5 39.9,84.5 | 39.9,84.5 39.5,84.9 | 39.9,84.5 49.7,84.5 | 52.5,84.5 52.9,84.9 | 52.9,84.9 53.1,85.1 53.1,85.4 | 53.1,85.4 53.6,84.9
MCU_MISO
  Bottom 0.5: IC1.2 21.9,25.9 20.87,24.87 X1.6
  pour Bottom (no thermals): 19.1,25.2 19.1,24.8 19.4,24.5 20.5,24.5 20.8,24.8 21.4,25.4 20.9,25.4 20.6,25.7 19.6,25.7
MCU_MOSI
  Bottom 0.35: 19,23.6 21.2,23.6
  Bottom 0.5: IC1.1 22.7,25.1 21.2,23.6 | X1.3 18.67,23.6 19,23.6
  pour Bottom (no thermals): 17.1,23 16.8,23 16.6,22.8 16.6,21.4 16.8,21.2 17.5,21.2 17.9,21.6 18,21.7 18,22.6 18,23 17.2,23
MCU_RST
  Bottom 0.5: 14.86,27.14 14.5,27.5 R1.PAD_1 14.55,27.5 IC1.4
  Bottom 0.8: X1.2 14.86,27.14
  pour Bottom (no thermals): 13.9,25.9 13.9,24.6 14.3,24.2 15.4,24.2 15.7,24.5 15.7,25.8 15.2,26.3 14.3,26.3
MCU_SCK
  Bottom 0.5: IC1.3 19.23,26.7 X1.4
  pour Bottom (no thermals): 16.7,25.6 16.7,24.5 17,24.2 17.7,24.2 18,24.5 18,25.5 18.7,26.2 17.1,26.2 16.7,25.8
N$1
  Bottom 0.5: IC7.13 IC7.14
N$2
  Bottom 0.5: IC7.8 IC7.9
N$3
  Bottom 0.5: IC7.7 IC7.6
N$4
  Bottom 0.5: IC7.2 8.54,20.56 9.4,19.7
  Bottom 0.8: R54.PAD_0 10.15,17.65 9.5,18.3 9.5,19.6 9.4,19.7 | R54.PAD_0 C16.PAD_1 | R58.PAD_1 12.15,16.35 11.9,16.6 11.9,17.35 R54.PAD_0
N$5
  Bottom 0.5: IC7.1 9.81,21.2 10.5,21.2 11.1,20.6 11.1,19.75 R54.PAD_1
  Bottom 0.8: R54.PAD_1 C16.PAD_0 15.55,19.75 15.7,19.6 16.07,19.6 R59.PAD_0
N$6
  Bottom 0.5: 39.5,3.1 R74.PAD_1
  Bottom 0.8: C39.PAD_0 R74.PAD_1 | T7.1 41.6,5.1 40.9,5.1 40.3,5.7 C39.PAD_0 | C39.PAD_0 39.55,6.75 40.9,8.1 41.4,8.1 41.9,8.6 T3.1
N$7
  Bottom 0.5: IC1.10 22.2,32.3 21.6,32.9 21.6,36.6 20.2,38 20.2,39.2 20.05,39.35 R10.PAD_0
N$8
  Bottom 0.5: IC1.12 24.7,34.9 24,35.6 24,38.2 24.2,38.4 24.2,38.9 24.4,39.1 25.15,39.1 R8.PAD_1
N$9
  Bottom 0.8: R55.PAD_1 C17.PAD_0 21.55,8.4 20.9,8.4 20.5,8 20,8 T1.1 19.8,7.6 19.8,6.9 20.3,6.4 20.3,4.1 19.8,3.6 19.8,2.9 T2.1
N$10
  Bottom 0.7: IC10.2 22.55,63.03 D27.CATHODE
  Bottom 2: TR1.W1_END 27.36,71.36 22.6,66.6 D27.CATHODE
N$11
  Bottom 0.8: T2.2 17.1,3 15.32,3 arc-90 R56.PAD_0 15,3.5 15,4.8 16.1,5.9 16.1,7.1 16.5,7.5 17.1,7.5 T1.2
N$12
  pour Bottom (no thermals): 9.2,9.7 7,9.7 6.6,9.3 6.6,4.2 7.3,3.5 9.6,3.5 10.3,2.8 11.8,2.8 11.8,4.6 10.3,6.1 10.3,6.6 9.7,7.2 9.7,9.2
N$13
  Bottom 0.8: R57.PAD_0 12,12.18 12,9.28 D8.ANODE
N$14
  Bottom 0.5: IC3.15 19.43,91.08 19,91.5 18.3,91.5 17.4,92.4 15.95,92.4 R22.PAD_0
N$15
  Bottom 0.4: 18.3,102.8 18.3,106.7
  Bottom 0.5: IC3.1 18.16,96.86 18.4,97.1 18.4,102.7 18.3,102.8
  Bottom 0.8: 18.3,106.7 18.3,113.5 17.5,114.3 17.5,115.05 R23.PAD_0
N$16
  Bottom 0.5: IC3.2 19.43,97.12 20,97.7 20,98.6 20.2,98.8 R24.PAD_0
N$17
  Bottom 0.4: 20.8,103.1 20.8,106
  Bottom 0.5: 20.8,103.1 21.9,102 21.9,98.1 20.7,96.89 IC3.3 | 19.7,107.1 20.8,106
  Bottom 0.8: 19.7,107.1 19.7,115.25 R25.PAD_0
N$18
  Bottom 0.4: 23.4,102.8 23.4,106
  Bottom 0.5: 23.4,102.8 22.8,102.2 22.8,97.6 21.96,96.77 IC3.4 | 23.4,106 24.6,107.2
  Bottom 0.8: R26.PAD_0 24.6,114.95 24.6,107.2
N$19
  Bottom 0.8: R11.PAD_1 3.9,101.45 3.9,103 4.32,103.42 LI1.1
N$20
  Bottom 0.8: LI1.2 6.86,101.15 R13.PAD_1
N$21
  Bottom 0.8: LI1.4 11.94,102.54 11.6,102.2 11.6,101.45 R16.PAD_1
N$22
  Bottom 0.5: IC3.5 23.23,96.64 24,97.4 24,98.35 arc-90 R27.PAD_0
N$23
  Bottom 0.8: R20.PAD_1 arc-90 14.48,101.27 LI1.5
N$24
  Bottom 0.8: R12.PAD_1 4.3,119.8 LI1.10
N$25
  Bottom 0.8: R58.PAD_0 9.95,15.1 C18.- | C19.PAD_1 7.12,15.46 C18.- | C18.- 6.55,14.88 R60.PAD_0 8.68,12.1 R57.PAD_1
N$26
  Bottom 0.4: 25.9,102.9 25.9,106.3
  Bottom 0.5: IC3.6 24.5,96.5 26.1,98.1 26.1,102.7 25.9,102.9
  Bottom 0.8: 25.9,106.3 26.2,106.6 26.2,113.9 26.6,114.3 26.6,114.95 R28.PAD_0
N$27
  Bottom 0.8: R14.PAD_1 6.86,117.69 LI1.9
N$28
  Bottom 0.8: LI1.7 11.94,118.34 11.8,118.2 11.8,117.75 R15.PAD_1
N$29
  Bottom 0.8: LI1.6 14.48,117.73 R18.PAD_1
N$30
  Bottom 0.5: IC2.15 5.83,91.38 3.4,93.8 3.4,97.8 3.6,98 R11.PAD_0
N$31
  Bottom 0.4: 5.6,106.4 5.6,102.7
  Bottom 0.5: 4.3,107.7 5.6,106.4 | IC2.1 4.55,97.25 5.4,98.1 5.4,102.5 5.6,102.7
  Bottom 0.8: 4.3,107.7 R12.PAD_0
N$32
  Bottom 0.5: R13.PAD_0 6.85,99.05 6.7,98.9 6.7,97.8 5.83,96.92 IC2.2
N$33
  Bottom 0.4: 8.1,103.4 8.1,106.1
  Bottom 0.5: 7.1,107.1 8.1,106.1 | IC2.3 7.09,96.69 8.7,98.3 8.7,102.2 8.1,102.8 8.1,103.4
  Bottom 0.8: 7.1,107.1 R14.PAD_0
N$34
  Bottom 0.4: 10.7,103 10.7,106.2
  Bottom 0.5: IC2.4 8.37,96.56 9.8,98 9.8,102.1 10.7,103 | 10.7,106.2 11.6,107.1
  Bottom 0.8: R15.PAD_0 11.6,115.05 11.6,107.1
N$35
  Bottom 0.5: 9.6,95.53 IC2.5 9.63,96.44 11.1,97.9 11.1,98.8 11.35,99.05 R16.PAD_0
N$36
  Bottom 0.4: 13.2,106.5 13.2,102.9
  Bottom 0.5: IC2.6 10.9,96.31 13.2,98.6 13.2,102.9
  Bottom 0.8: R18.PAD_0 14.1,114.4 13.2,113.5 13.2,106.5
N$37
  Bottom 0.5: IC2.7 12.18,96.28 13.1,97.2 13.6,97.2 14.3,97.9 14.3,98.4 arc-90 14.75,98.85 R20.PAD_0
N$38
  Bottom 0.5: IC3.7 25.77,96.38 27.3,97.9 27.3,98.45 R29.PAD_0
N$39
  Bottom 0.8: T3.2 45.2,9.7 45.6,9.3 | 45.6,9.3 45.9,9 | 45.9,9 45.6,8.7 | 45.6,8.7 45.6,9.3 | 45.6,8.7 45.6,5.5 45.2,5.1 44.6,5.1 T7.2 | R73.PAD_0 45.9,9
N$40
  Bottom 0.5: LI2.1 17.02,102.68 17.5,102.2 17.5,97.6 16.3,96.4 16.3,95.15 arc-90 R22.PAD_1
N$41
  Bottom 0.8: LI2.2 19.56,102.64 19.9,102.3 19.9,101.25 R24.PAD_1
N$42
  Bottom 0.8: LI2.4 24.64,101.09 R27.PAD_1
N$43
  Bottom 0.8: LI2.5 27.18,103.12 27.4,102.9 27.4,101.25 R29.PAD_1
N$44
  Bottom 0.8: LI2.10 17.02,117.63 R23.PAD_1
N$45
  Bottom 0.8: LI2.9 19.56,117.69 R25.PAD_1
N$46
  Bottom 0.8: LI2.7 24.64,117.69 R26.PAD_1
N$47
  Bottom 0.8: LI2.6 27.18,117.63 R28.PAD_1
N$48
  Bottom 0.5: R30.PAD_0 29.9,92.05 29.9,91.8 30.1,91.6 32.5,91.6 33.02,91.08 IC4.15
N$49
  Bottom 0.4: 31,103.1 31,106.3
  Bottom 0.5: IC4.1 31.75,97.05 31.4,97.4 31.4,102.7 31,103.1
  Bottom 0.8: 31,106.3 31,113.7 30.6,114.1 30.6,114.85 R31.PAD_0
N$50
  Bottom 0.5: R32.PAD_0 33,95.42 IC4.2
N$51
  Bottom 0.4: 33.5,106.4 33.5,103
  Bottom 0.5: IC4.3 34.3,97.19 34.7,97.6 34.7,101.8 33.5,103 | 33.5,106.4 32.4,107.5
  Bottom 0.8: 32.4,107.5 32.4,115.25 R33.PAD_0
N$52
  Bottom 0.4: 36.1,103 36.1,106.3
  Bottom 0.5: IC4.4 35.56,96.97 35.7,97.1 35.7,102.6 36.1,103 | 36.1,106.3 37.2,107.4
  Bottom 0.8: 37.2,107.4 37.2,113.9 36.8,114.3 R34.PAD_0
N$53
  Bottom 0.5: IC4.5 36.84,97.73 37.1,98 37.1,98.55 R35.PAD_0
N$54
  Bottom 0.4: 38.6,106.6 38.6,102.7
  Bottom 0.5: IC4.6 38.1,96.91 39,97.8 39,102.3 38.6,102.7
  Bottom 0.8: 38.6,106.6 38.6,113.2 39.4,114 R36.PAD_0
N$55
  Bottom 0.5: IC4.7 39.38,96.78 40.2,97.6 40.2,98.45 R37.PAD_0
N$56
  Bottom 0.5: LI3.1 29.72,102.88 30.4,102.2 30.4,97.3 29.4,96.3 R30.PAD_1
N$57
  Bottom 0.5: LI3.2 32.26,103.24 32.5,103 32.5,101.45 R32.PAD_1
N$58
  Bottom 0.8: LI3.4 37.34,101.01 R35.PAD_1
N$59
  Bottom 0.5: LI3.5 39.88,102.92 40.2,102.6 40.2,101.35 R37.PAD_1
N$60
  Bottom 0.8: R31.PAD_1 29.8,117.75 29.8,119.74 LI3.10
N$61
  Bottom 0.8: R33.PAD_1 32.8,118.4 32.3,118.9 32.3,119.78 LI3.9
N$62
  Bottom 0.8: R34.PAD_1 37.1,117.55 37.1,118.6 37.34,118.84 LI3.7
N$63
  Bottom 0.8: R36.PAD_1 39.7,117.55 39.7,118.5 39.88,118.68 LI3.6
N$64
  Bottom 0.5: R38.PAD_0 43.25,92.3 44.2,92.3 44.5,92 45.8,92 46.62,91.17 IC5.15
N$65
  Bottom 0.5: IC5.1 45.35,96.34 44.1,97.6 44.1,102.8 43.7,103.2 43.7,106.3
  Bottom 0.8: R39.PAD_0 43.2,114.85 43.2,114.2 43.7,113.7 43.7,106.3
N$66
  Bottom 0.5: IC5.2 46.62,96.78 45.7,97.7 R40.PAD_0
N$67
  Bottom 0.4: 46.2,103.3 46.2,106.2
  Bottom 0.5: 45.2,107.2 46.2,106.2 | IC5.3 47.9,97.11 47.4,97.6 47.4,102.1 46.2,103.3
  Bottom 0.8: 45.2,107.2 45.2,114.85 R41.PAD_0
N$68
  Bottom 0.4: 48.8,103.1 48.8,106.2
  Bottom 0.5: IC5.4 49.16,97.23 48.3,98.1 48.3,102.6 48.8,103.1 | 49.8,107.2 48.8,106.2
  Bottom 0.8: R42.PAD_0 49.7,114.85 49.7,113.9 50,113.6 50,107.4 49.8,107.2
N$69
  Bottom 0.5: R43.PAD_0 50,98.1 50.44,97.67 IC5.5
N$70
  Bottom 0.4: 51.3,102.9 51.3,106.6
  Bottom 0.5: IC5.6 51.7,96.39 51.6,96.5 51.6,102.6 51.3,102.9
  Bottom 0.8: 51.3,106.6 51.3,113.6 51.8,114.1 51.8,114.85 R44.PAD_0
N$71
  Bottom 0.5: IC5.7 52.98,98.53 R45.PAD_0
N$72
  Bottom 0.5: LI4.1 42.42,103.18 43.2,102.4 43.2,94.65 R38.PAD_1
N$73
  Bottom 0.5: LI4.2 44.96,103.14 45.4,102.7 45.4,101.25 R40.PAD_1
N$74
  Bottom 0.8: R43.PAD_1 50.04,100.99 LI4.4
N$75
  Bottom 0.5: LI4.5 52.58,102.92 52.9,102.6 52.9,101.2 53.15,100.95 R45.PAD_1
N$76
  Bottom 0.8: R39.PAD_1 42.5,117.65 42.5,118.6 42.42,118.68 LI4.10
N$77
  Bottom 0.8: R41.PAD_1 45.1,117.65 45.1,118.5 44.96,118.64 LI4.9
N$78
  Bottom 0.8: R42.PAD_1 49.8,117.65 49.8,118.3 50.04,118.54 LI4.7
N$79
  Bottom 0.8: R44.PAD_1 52.5,117.65 52.5,118.4 52.58,118.48 LI4.6
N$80
  Bottom 0.5: R46.PAD_0 58.85,92.55 60.23,91.17 IC6.15
N$81
  Bottom 0.5: IC6.1 58.95,95.9 58.7,95.9 56.9,97.7 56.9,102.8 56.4,103.3 56.4,106
  Bottom 0.8: R47.PAD_0 55.8,114.85 55.8,114.1 56.4,113.5 56.4,106
N$82
  Bottom 0.5: IC6.2 60.23,96.38 59.1,97.5 59.1,98.85 R48.PAD_0
N$83
  Bottom 0.4: 58.9,106.4 58.9,103.1
  Bottom 0.5: 58.9,103.1 60.3,101.7 60.3,97.7 61.49,96.5 IC6.3
  Bottom 0.8: R49.PAD_0 57.8,115.15 57.8,107.5 58.9,106.4
N$84
  Bottom 0.4: 61.5,102.7 61.5,106.5
  Bottom 0.5: IC6.4 62.77,96.64 61.3,98.1 61.3,102.5 61.5,102.7
  Bottom 0.8: R50.PAD_0 63,114.75 63,108 61.5,106.5
N$85
  Bottom 0.5: IC6.5 64.03,97.06 63.4,97.7 63.4,98.45 R51.PAD_0
N$86
  Bottom 0.5: IC6.6 65.31,97.3 64.6,98 64.6,102.4 64,103 64,106.6
  Bottom 0.8: 64,106.6 64.6,107.2 64.6,113.5 65,113.9 65,114.75 R52.PAD_0
N$87
  Bottom 0.5: R53.PAD_0 66.58,98.58 IC6.7
N$88
  Bottom 0.5: LI5.1 55.12,103.28 55.9,102.5 55.9,96.5 56.6,95.8 R46.PAD_1
N$89
  Bottom 0.5: LI5.2 57.66,103.44 58,103.1 58,101.8 58.2,101.6 58.2,101.35 R48.PAD_1
N$90
  Bottom 0.8: R51.PAD_1 62.74,100.95 LI5.4
N$91
  Bottom 0.8: R53.PAD_1 66.3,102.5 65.3,103.5 65.3,104.56 LI5.5
N$92
  Bottom 0.8: R47.PAD_1 55.1,117.65 55.1,118.8 55.12,118.82 LI5.10
N$93
  Bottom 0.8: R49.PAD_1 57.7,117.65 57.7,118.6 57.66,118.64 LI5.9
N$94
  Bottom 0.8: R50.PAD_1 62.74,117.19 LI5.7
N$95
  Bottom 0.8: R52.PAD_1 65.28,117.17 LI5.6
N$96
  Bottom 0.4: 47.9,86.1 47.9,88.9
  Bottom 0.5: IC4.9 40.65,88.95 41.3,88.3 41.3,86.1 41.9,85.5 47.3,85.5 47.9,86.1 | IC5.14 47.9,88.91 47.9,88.9
N$97
  Bottom 0.4: 34,85.9 34,88.5
  Bottom 0.5: IC3.9 27.05,88.36 27.4,88 27.4,86.5 28,85.9 31.2,85.9 31.6,85.5 33.6,85.5 34,85.9 | IC4.14 34.3,88.8 34,88.5
N$98
  Bottom 0.4: IC3.14 20.7,86.3
  Bottom 0.5: 20.7,86.3 20,85.6 18.6,85.6 15.8,88.4 14.2,88.4 13.45,89.16 IC2.9
N$99
  Bottom 0.4: 61.5,86.1 61.5,88.8
  Bottom 0.5: IC5.9 54.24,89.5 54.7,89.5 55.6,88.6 55.6,87.2 56.9,85.9 61.3,85.9 61.5,86.1 | IC6.14 61.49,88.81 61.5,88.8
N$100
  Bottom 0.5: IC1.37 30.9,22.2 31.3,21.8 31.3,18.5 30.8,18 30.8,16.12 J100.PAD_1
N$101
  Bottom 0.4: X4.2 8.4,76.05 J11.PAD_0
N$103
  Bottom 0.5: IC3.12 23.23,88.47 23.9,87.8 23.9,86.75 arc90 J4.PAD_1
N$107
  Bottom 0.5: IC6.12 64.03,86.53 63.7,86.2 63.7,85.15 J10.PAD_1
N$108
  Bottom 0.5: IC5.12 50.44,86.97 50.8,86.6 50.8,86.05 J8.PAD_1
N$109
  Bottom 0.5: IC4.12 36.84,85.55 J6.PAD_1
N$110
  Bottom 0.5: IC1.8 22.2,30.7 19.41,33.49 Q1.2
  Bottom 0.8: C2.PAD_1 20.05,33.84
  pour Bottom (no thermals): 19.3,34 20.1,34 20.3,33.8 20.3,32.6 19.8,33.1 19.2,33.1 18.7,33.6 18.7,33.9 18.8,34 19.1,34
N$111
  Bottom 0.5: IC1.7 21.4,29.9 19.1,32.2 18.7,32.2 17.4,33.5 Q1.1
  Bottom 0.8: C1.PAD_1 13.45,34.35 14.3,33.5 Q1.1
  pour Bottom (no thermals): 14,34 14,33.2 14.4,32.8 14.9,32.8 15.6,33.5 15.2,33.9 14.7,33.9 14.1,33.9
N$112
  Bottom 0.5: IC1.11 23.2,33.1 | R9.PAD_1 22.5,37.6 22.8,37.3 22.8,34.5 23.2,34.1 23.2,33.1 | 23,33.1 23.2,33.1
N$113
  Bottom 0.8: C40.PAD_1 R73.PAD_1 50.62,6.12 C44.PAD_1
N$114
  Bottom 0.8: D26.ANODE D25.CATHODE
  pour Bottom (no thermals): 60.9,3.1 62.8,3.1 63.3,3.6 63.3,6.7 62.8,7.2 62,8 59.5,8 58.8,8.7 58.8,9.8 58,10.6 56.7,10.6 56.5,10.4 56.5,6.3 56.7,6.1 59.1,6.1 60,5.2 60,3.6 60.5,3.1
N$115
  Bottom 0.4: T4.1 62.1,15 61.5,15 61,14.5 61,11.6
  Bottom 0.8: R75.PAD_1 64.75,15.2 63.7,15.2 | 63.7,15.2 T4.1 | R67.PAD_0 63.7,17.65 63.7,15.2 | C41.PAD_0 61,11.6
N$116
  Bottom 0.8: T4.3 57.5,14 57.3,14.2 57.3,15.25 C22.PAD_1 57.25,16.35 57.7,16.8 57.7,17.65 R68.PAD_0 C42.PAD_1
N$117
  Bottom 0.8: T4.2 62.4,12.7 63.3,12.7 63.7,12.3 64.65,12.3 R76.PAD_1
N$118
  Bottom 0.4: 61,21.5 61,24.6 61.4,25 62.3,25 T5.1
  Bottom 0.8: T5.1 64.95,25.2 R77.PAD_1 64.95,26.45 64.3,27.1 64.3,27.95 R69.PAD_0 | C42.PAD_0 61,21.5
N$119
  Bottom 0.8: C43.PAD_1 R70.PAD_0 57.7,27.65 57.7,26.8 57.05,26.15 C23.PAD_1 57.35,24.7 58,24.7 58.7,24 T5.3
N$120
  Bottom 0.8: R78.PAD_1 64.65,22.8 T5.2
N$121
  Bottom 0.4: 60.7,31.6 60.7,32.3 61,32.6 61,34.6 61.3,34.9 62,34.9 T6.1
  Bottom 0.8: C43.PAD_0 60.7,30.35 60.7,31.6 | R71.PAD_0 62,35.5 arc90 T6.1 63.5,35.2 63.9,35.6 64.95,35.6 R79.PAD_1
N$122
  Bottom 0.8: C24.PAD_1 57.35,34.2 59.5,34.2 T6.3 59.3,34.4 59.3,37.65 R72.PAD_0
N$123
  Bottom 0.8: R80.PAD_1 64.75,32.8 T6.2
N$124
  Bottom 0.8: R61.PAD_0 R86.PAD_1 C28.PAD_1 45.92,15.55 C27.+ 47.23,15.5 D14.CATHODE
N$125
  Bottom 0.8: D18.CATHODE D14.ANODE 52.58,15.3 C22.PAD_0
N$126
  Bottom 0.4: R68.PAD_1 58.15,19.9 59,19.9 59.9,19 62.2,19 63,19.8 63.75,19.8 R67.PAD_1
  Bottom 0.8: R64.PAD_1 57.1,22.35 57.1,21.4 57.6,20.9 57.6,20.45 R68.PAD_1 | R67.PAD_1 C35.PAD_0
N$127
  Bottom 0.8: C31.PAD_1 R62.PAD_0 R87.PAD_1 C30.+ 48.4,24.77 D15.CATHODE
N$128
  Bottom 0.8: C23.PAD_0 D15.ANODE D20.CATHODE
N$129
  Bottom 0.4: R70.PAD_1 58.25,29.8 59,29.8 59.8,29 62.1,29 62.9,29.8 63.75,29.8 R69.PAD_1
  Bottom 0.8: R65.PAD_1 R70.PAD_1 | R69.PAD_1 C36.PAD_0
N$130
  Bottom 0.8: R63.PAD_0 43.6,36.15 43.6,34.3 43.75,34.3 C34.PAD_1 46.28,34.05 C33.+ | R88.PAD_1 46.3,36.45 46.3,35.1 46.5,35.1 C33.+ | D16.CATHODE 46.5,34.5 C33.+
N$131
  Bottom 0.8: D22.CATHODE D16.ANODE C24.PAD_0
N$133
  pour Bottom (no thermals): 14.6,63 15.9,63 16.5,62.4 16.5,61.7 18.2,61.7 18.2,63.3 18.2,63.8 18.6,64.2 18.7,64.3 20,64.3 20,65.9 19.7,66.2 13.6,66.2 13.2,65.8 12.9,65.5 12.7,65.3 11.4,65.3 11.4,64 12.9,64 13.4,63.5 13.4,63.2 13.6,63
N$134
  Bottom 0.8: R66.PAD_1 56.65,39.25 57.4,40 58.95,40 R72.PAD_1 R71.PAD_1 62.05,40 C37.PAD_0
N$135
  Bottom 0.5: IC10.3 20.93,61.77 21.75,60.95 C55.PAD_1
N$136
  Bottom 2: TR1.W2_START 43.25,77.5 D29.ANODE
N$137
  pour Bottom (no thermals): 3.3,52.7 11.4,52.7 13.2,50.9 13.5,50.6 15.6,50.6 20.2,50.6 20.5,50.9 20.8,51.2 20.8,52.7 21.7,53.6 22.8,53.6 22.9,53.5 22.9,52.2 22.1,51.4 22.1,50.9 18.6,47.4 15.1,47.4 12.1,44.4 8.9,44.4 3.3,44.4 3.3,52.1
N$138
  Bottom 2: TR1.W3_START 43.2,67.29 D28.ANODE
N$139
  Bottom 0.7: 14.5,59.9 IC10.5
  Bottom 0.8: R85.PAD_1 17.63,57.92 R84.PAD_0 14.5,58.82 14.5,59.9
N$140
  pour Bottom (no thermals): 42.4,56.7 42.4,51.4 42.6,51.2 45.4,51.2 47.4,53.2 48,53.8 51.1,53.8 51.9,53.8 53.7,55.6 53.7,57.8 53.5,58 50.8,58 50.3,58.5 47.7,58.5 47.4,58.2 47.4,57.7 46.4,56.7
N$141
  Bottom 0.5: IC1.29 36.3,28.3 36.6,28 37.75,28 C3.PAD_1
N$142  (1 unrouted)
  Bottom 0.8: R82.PAD_1 40.35,67.9 R81.PAD_1 40.35,64.45 42.8,62 42.8,61.3 43.71,61.3 IC9.1
N$144
  Bottom 0.5: KEY1.2 61.6,69.85 61.6,61.6 61,61 61,51.9 59.1,50 59.1,49.25 R5.PAD_0
  Bottom 1: KEY1.1 63.95,79 R2.PAD_0 63.95,72 KEY1.2
N$145
  Bottom 0.5: KEY2.2 62,60.25 62,49.9 61.8,49.7 61.8,49.25 R6.PAD_0
  Bottom 1: KEY2.1 63.95,69 R3.PAD_0 63.95,62 KEY2.2
N$146
  Bottom 1: KEY3.1 63.95,59 R4.PAD_0 63.95,52 63.8,52 | KEY3.2 63.8,52 | R7.PAD_0 64.2,50.1 63.8,50.5 63.8,52
USB_D+
  Bottom 0.35: 12.97,77.7 X5.3
  Bottom 0.4: X4.3 6.8,76.7 7.3,77.2 10,77.2 10.5,77.7 12.97,77.7 | X5.3 13.73,77.67 15,76.4 17.9,76.4 18.3,76.8
  Bottom 0.5: R10.PAD_1 19.7,42.3 20.1,42.7 26.9,42.7 27.5,42.1 32.4,42.1 39.3,49 46.2,49 48.9,51.7 53.2,51.7 55.9,54.4 55.9,63.1 56.5,63.7 56.5,77.7 54.8,79.4 53.5,79.4 52.7,80.2 49.2,80.2 48.9,80.5 40.1,80.5 39.7,80.1 28.1,80.1 26.8,78.8 24.7,78.8 23.3,77.4 19.98,77.4 ZD2.CATHODE 19.38,76.8 18.3,76.8
USB_D-
  Bottom 0.5: J11.PAD_1 9.55,78.25 10.4,79.1 14.11,79.1 X5.2 16.87,77.67 18.2,79 20.8,79 21.1,78.7 23.1,78.7 24.4,80 25.98,80 ZD1.CATHODE 26.38,81.1 39.1,81.1 39.5,81.5 49.3,81.5 49.6,81.2 53.1,81.2 53.9,80.4 55.3,80.4 57.4,78.3 57.4,63.2 56.9,62.7 56.9,53.8 53.8,50.7 49.5,50.7 46.9,48.1 39.8,48.1 32.8,41.1 26.8,41.1 26.45,41.45 R8.PAD_0
  Bottom 0.8: R8.PAD_0 R9.PAD_0
VCC_ROUGH  (via drill 0.8 pad 1.6)
  Top 0.5: v16.8,90 v28.7,90 | v30.4,90 v42.4,90 | v44,90 v56.6,90 | v58.4,87.6 v66.9,87.6 | v53.9,87.8 v53.9,76.5 | v15.2,90 v2.8,90
  Bottom 0.5: IC3.10 25.77,91.17 26.1,91.5 28,91.5 28.7,90.8 v28.7,90 | IC4.10 39.38,91.28 39.6,91.5 41.5,91.5 42,91 | IC2.10 12.18,91.17 12.5,91.5 14.2,91.5 15.2,90.5 v15.2,90 | C11.PAD_1 18.9,87.4 18.16,88.14 IC3.16 | v30.4,90 IC4.16 | C14.PAD_1 60.35,87.6 v58.4,87.6 | IC6.10 66.6,89.98 66.6,87.9 v66.9,87.6 | v53.9,87.8 53.6,87.8 52.98,88.42 IC5.10 52.98,91.08 53.5,91.6 55,91.6 v56.6,90 | 47.6,75.3 42.1,75.3 39.3,78.1 30.2,78.1 25,72.9 25,71.9 21.18,68.08 R84.PAD1 | C12.PAD_1 32.95,87.7
  Bottom 1.6: v15.2,90 v16.8,90
  pour Bottom (no thermals): 49,78.1 47,76.1 47,75.8 46.6,75.4 47.7,74.3 47.7,72.1 48.6,72.1 50,70.7 51.1,70.7 51.7,71.3 51.7,75.2 52.4,75.9 54,75.9 54,77 52.9,77 51.8,78.1
  pour Bottom (no thermals): 28.2,90 28.2,88.8 28.6,88.4 28.7,88.3 28.7,87.2 28.9,87 30.6,87 31.7,87 32,86.7 33.1,86.7 33.1,87.7 32.2,87.7 31.8,88.1 31.8,90
  pour Bottom (no thermals): 6.1,86.9 2.2,86.9 1.7,87.4 1.7,90.4 2.1,90.8 4.3,90.8 4.6,90.5 4.6,88.6 5.2,88 5.3,87.9 6.1,87.9
  pour Bottom (no thermals): 46.8,87.2 45.3,87.2 44.7,86.6 42.9,86.6 42.9,88.5 42.5,88.9 41.8,89.6 41.8,90 41.8,91 45.2,91 45.4,90.8 45.4,88.6 45.9,88.1 46.8,88.1
  pour Bottom (no thermals): 60.6,87 60.6,88 59.5,88 59,88.5 59,90.8 58.7,91.1 55.5,91.1 56.1,90.5 56.1,89.8 56.6,89.3 56.6,87.9 57.5,87
  pour Bottom (no thermals): 16.8,90.5 18.1,90.5 18.2,90.5 18.2,89.7 18.2,88.1 18.8,87.5 18.9,87.4 18.3,87.4 17,88.7 16.2,89.5 16.2,90.5